# EAGLE schematic sistem minimum (EAGLE 4.11)
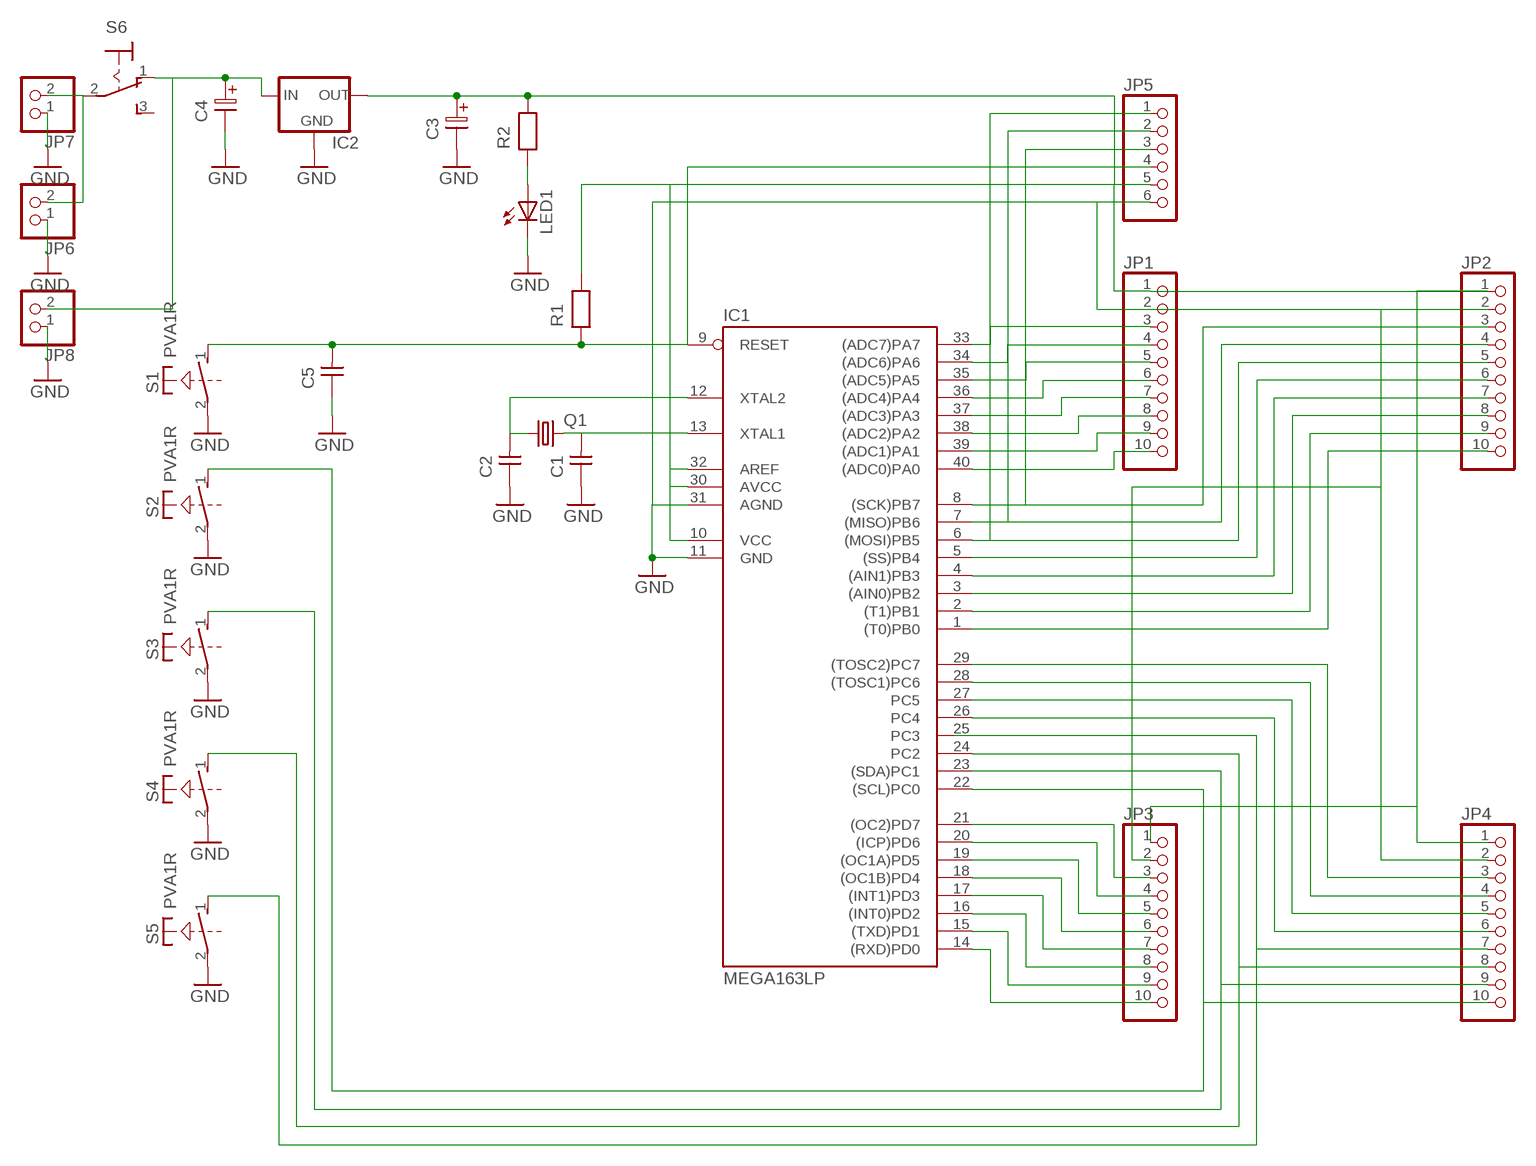
[diagram p0: schematic, sheet 1]

## Parts
C1  CAPNP-5  [C-5]
C2  CAPNP-5  [C-5]
C3  ELC-5  [ES-5]
C4  ELC-7,5  [ES-7,5]
C5  CAPNP-5  [C-5]
IC1  MEGA163LP  [DIL40]
IC2  78XXL  [78XXL]
JP1  PINHD-1X10  [1X10]
JP2  PINHD-1X10  [1X10]
JP3  PINHD-1X10  [1X10]
JP4  PINHD-1X10  [1X10]
JP5  PINHD-1X6  [1X06]
JP6  PINHD-1X2  [1X02]
JP7  PINHD-1X2  [1X02]
JP8  PINHD-1X2  [1X02]
LED1  LED3MM  [LED3MM]
Q1  CRYTALHC49U70  [HC49U70]
R1  RESEU-10  [R-10]
R2  RESEU-10  [R-10]
S1  PVA1R  [PVA1R]
S2  PVA1R  [PVA1R]
S3  PVA1R  [PVA1R]
S4  PVA1R  [PVA1R]
S5  PVA1R  [PVA1R]
S6  M9040P  [M9040P]

## Nets
GND: C1.1 C2.1 C3.2 C4.2 C5.1 IC1.11(GND) IC1.31(AGND) IC2.GND JP1.2 JP2.2 JP3.2 JP4.2 JP5.6 JP6.1 JP7.1 JP8.1 LED1.K(C) S1.2(1:P) S2.2(1:P) S3.2(1:P) S4.2(1:P) S5.2(1:P)
N$1: IC1.40((ADC0)PA0) JP1.10
N$2: IC1.39((ADC1)PA1) JP1.9
N$3: IC1.38((ADC2)PA2) JP1.8
N$4: IC1.37((ADC3)PA3) JP1.7
N$5: IC1.36((ADC4)PA4) JP1.6
N$6: IC1.35((ADC5)PA5) JP1.5
N$7: IC1.34((ADC6)PA6) JP1.4
N$8: IC1.33((ADC7)PA7) JP1.3
N$9: IC1.8((SCK)PB7) JP2.3 JP5.3
N$10: IC1.7((MISO)PB6) JP2.4 JP5.2
N$11: IC1.6((MOSI)PB5) JP2.5 JP5.1
N$12: IC1.5((SS)PB4) JP2.6
N$13: IC1.4((AIN1)PB3) JP2.7
N$14: IC1.3((AIN0)PB2) JP2.8
N$15: IC1.2((T1)PB1) JP2.9
N$16: IC1.1((T0)PB0) JP2.10
N$17: IC1.14((RXD)PD0) JP3.10
N$18: IC1.22((SCL)PC0) JP4.10 S2.1(1:S)
N$19: IC1.15((TXD)PD1) JP3.9
N$20: IC1.16((INT0)PD2) JP3.8
N$21: IC1.17((INT1)PD3) JP3.7
N$22: IC1.18((OC1B)PD4) JP3.6
N$23: IC1.19((OC1A)PD5) JP3.5
N$24: IC1.20((ICP)PD6) JP3.4
N$25: IC1.21((OC2)PD7) JP3.3
N$26: IC1.23((SDA)PC1) JP4.9 S3.1(1:S)
N$27: IC1.24(PC2) JP4.8 S4.1(1:S)
N$28: JP4.7 S5.1(1:S)
N$29: IC1.26(PC4) JP4.6
N$30: IC1.27(PC5) JP4.5
N$31: IC1.28((TOSC1)PC6) JP4.4
N$32: IC1.29((TOSC2)PC7) JP4.3
N$33: JP6.2 JP7.2 S6.2(P)
N$34: C5.2 IC1.9(RESET) JP5.4 R1.1 S1.1(1:S)
N$35: C3.1 IC1.10(VCC) IC1.30(AVCC) IC1.32(AREF) IC2.OUT JP1.1 JP2.1 JP3.1 JP4.1 JP5.5 R1.2 R2.2
N$36: LED1.A R2.1
N$37: C1.2 IC1.13(XTAL1) Q1.2
N$38: C2.2 IC1.12(XTAL2) Q1.1
N$39: C4.1 IC2.IN JP8.2 S6.1(O)
Unconnected: IC1.25(PC3) S1.3(2:S) S1.4(2:P) S2.3(2:S) S2.4(2:P) S3.3(2:S) S3.4(2:P) S4.3(2:S) S4.4(2:P) S5.3(2:S) S5.4(2:P) S6.3(S)

## Library data of the parts
C1 C2 C5 = discrete:CAPNP-5
C3 = discrete:ELC-5
C4 = discrete:ELC-7,5
IC1 = atmel:MEGA163*P: MICROCONTROLLER 16 Kbytes FLASH, 1 Kbytes EEPROM 1 Kbytes SRAM UART 8-channel 10 bit ADC hardware multiplier
IC2 = v-reg:78XXL: VOLTAGE REGULATOR
JP1-JP4 = pinhead:PINHD-1X10: PIN HEADER
JP5 = pinhead:PINHD-1X6: PIN HEADER
JP6-JP8 = pinhead:PINHD-1X2: PIN HEADER
LED1 = led:LED: LED OSRAM: - CHIPLED LG R971, LG N971, LY N971, LG Q971, LY Q971, LO R971, LY R971 LH N974, LH R974 LS Q976, LO Q976, LY Q976 LO Q996 - Hyper CHIPLED LW Q18S LB Q993, LB Q99A, LB R99A - SideLED LS A670, LO A670, LY A670, LG A670, LP A670 LB A673, LV A673, LT A673, LW A673 LH A674 LY A675 LS A676, LA A676, LO A676, LY A676, LW A676 LS A679, LY A679, LG A679 - Hyper Micro SIDELED® LS Y876, LA Y876, LO Y876, LY Y876 LT Y87S - SmartLED LW L88C, LW L88S LB L89C, LB L89S, LG L890 LS L89K, LO L89K, LY L89K LS L896, LA L896, LO L896, LY L896 - TOPLED LS T670, LO T670, LY T670, LG T670, LP T670 LSG T670, LSP T670, LSY T670, LOP T670, LYG T670 LG T671, LOG T671, LSG T671 LB T673, LV T673, LT T673, LW T673 LH T674 LS T676, LA T676, LO T676, LY T676, LB T676, LH T676, LSB T676, LW T676 LB T67C, LV T67C, LT T67C, LS T67K, LO T67K, LY T67K, LW E67C LS E67B, LA E67B, LO E67B, LY E67B, LB E67C, LV E67C, LT E67C LW T67C LS T679, LY T679, LG T679 LS T770, LO T770, LY T770, LG T770, LP T770 LB T773, LV T773, LT T773, LW T773 LH T774 LS E675, LA E675, LY E675, LS T675 LS T776, LA T776, LO T776, LY T776, LB T776 LHGB T686 LT T68C, LB T68C - Hyper Mini TOPLED® LB M676 - Mini TOPLED Santana® LG M470 LS M47K, LO M47K, LY M47K Source: http://www.osram.convergy.de/
Q1 = crystal:CRYTAL: CRYSTAL
R1 R2 = discrete:RESEU-10
S1-S5 = switch-misc:PVA1R: ITT SWITCH
S6 = switch:M9040P: TOGGLE SWITCH Marquardt